# EAGLE design On Axis Encoder - Single Side (EAGLE 9.6.1)

## Sheet 1 of 7: MCU
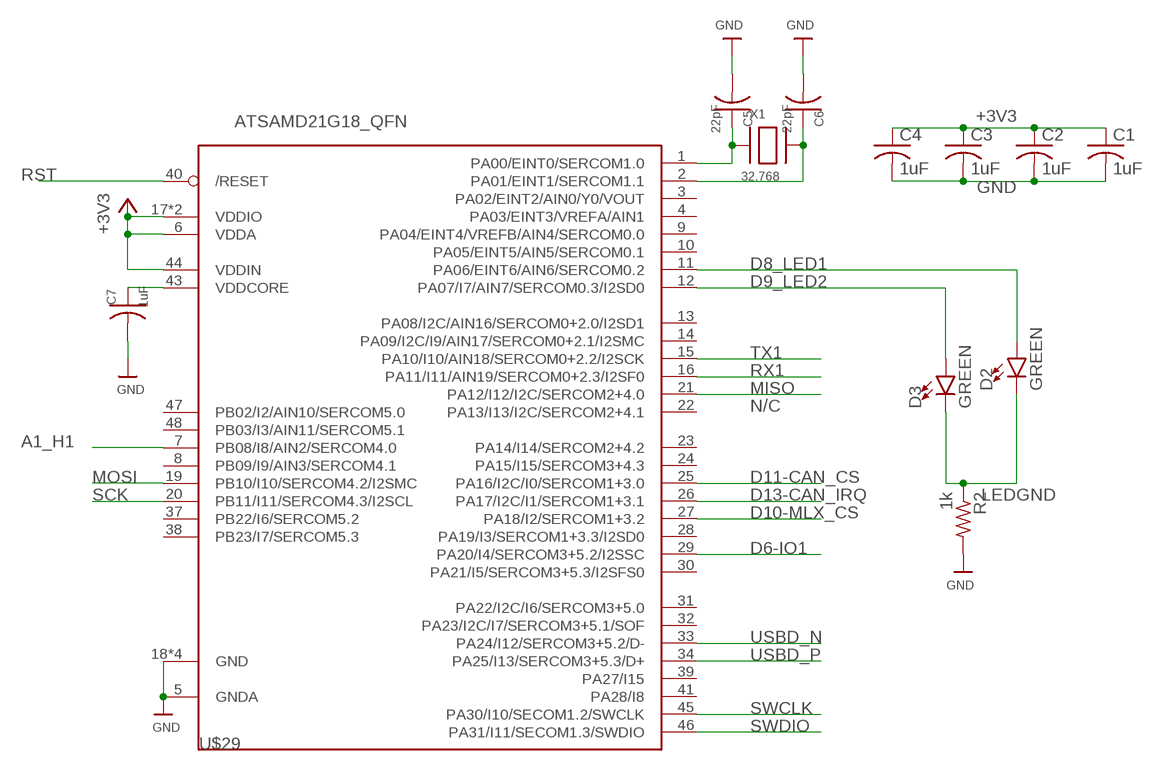
[diagram p0: schematic, sheet 1]

### Parts
C1  1uF  C-USC0603  [C0603]
C2  1uF  C-USC0603  [C0603]
C3  1uF  C-USC0603  [C0603]
C4  1uF  C-USC0603  [C0603]
C5  22pF  C-USC0603  [C0603]
C6  22pF  C-USC0603  [C0603]
C7  1uF  C-USC0603  [C0603]
D2  GREEN  LED-RED0603  [LED-0603]
D3  GREEN  LED-RED0603  [LED-0603]
R2  1k  R-US_R0603  [R0603]
U$29  ATSAMD21G18_QFN  ATSAMD21J_QFN  [MICROBUILDER_TQFN48_7MM]
X1  32.768  XTAL-3.2X1.5  [XTAL3215]

### Nets
+3V3: C1.1 C2.1 C3.1 C4.1 U$29.6(VDDA) U$29.17(VDDIO) U$29.36(VDDIO) U$29.44(VDDIN) ; also sheet 3,4,5,6
A1_H1: U$29.7(PB08/I8/AIN2/SERCOM4.0) ; also sheet 2
D6-IO1: U$29.29(PA20/I4/SERCOM3+5.2/I2SSC) ; also sheet 5
D8_LED1: D2.A U$29.11(PA06/EINT6/AIN6/SERCOM0.2)
D9_LED2: D3.A U$29.12(PA07/I7/AIN7/SERCOM0.3/I2SD0)
D10-MLX_CS: U$29.27(PA18/I2/SERCOM1+3.2) ; also sheet 3,5
D11-CAN_CS: U$29.25(PA16/I2C/I0/SERCOM1+3.0) ; also sheet 6
D13-CAN_IRQ: U$29.26(PA17/I2C/I1/SERCOM1+3.1) ; also sheet 6
GND: C1.2 C2.2 C3.2 C4.2 C5.2 C6.2 C7.2 R2.2 U$29.5(GNDA) U$29.18(GND) U$29.35(GND) U$29.42(GND) U$29.THERMAL(GND) ; also sheet 2,3,4,5,6
LEDGND: D2.C D3.C R2.1 ; also sheet 4
MISO: U$29.21(PA12/I12/I2C/SERCOM2+4.0) ; also sheet 3,5,6
MOSI: U$29.19(PB10/I10/SERCOM4.2/I2SMC) ; also sheet 3,5,6
N$9: C5.1 U$29.1(PA00/EINT0/SERCOM1.0) X1.P$1
N$10: C6.1 U$29.2(PA01/EINT1/SERCOM1.1) X1.P$2
RST: U$29.40(/RESET) ; also sheet 5
RX1: U$29.16(PA11/I11/AIN19/SERCOM0+2.3/I2SF0)
SCK: U$29.20(PB11/I11/SERCOM4.3/I2SCL) ; also sheet 3,5,6
SWCLK: U$29.45(PA30/I10/SECOM1.2/SWCLK) ; also sheet 5
SWDIO: U$29.46(PA31/I11/SECOM1.3/SWDIO) ; also sheet 5
TX1: U$29.15(PA10/I10/AIN18/SERCOM0+2.2/I2SCK)
USBD_N [diff pair]: U$29.33(PA24/I12/SERCOM3+5.2/D-) ; also sheet 5
USBD_P [diff pair]: U$29.34(PA25/I13/SERCOM3+5.3/D+) ; also sheet 5
VDDCORE2: C7.1 U$29.43(VDDCORE)
Unconnected: U$29.3(PA02/EINT2/AIN0/Y0/VOUT) U$29.4(PA03/EINT3/VREFA/AIN1) U$29.8(PB09/I9/AIN3/SERCOM4.1) U$29.9(PA04/EINT4/VREFB/AIN4/SERCOM0.0) U$29.10(PA05/EINT5/AIN5/SERCOM0.1) U$29.13(PA08/I2C/AIN16/SERCOM0+2.0/I2SD1) U$29.14(PA09/I2C/I9/AIN17/SERCOM0+2.1/I2SMC) U$29.22(PA13/I13/I2C/SERCOM2+4.1) U$29.23(PA14/I14/SERCOM2+4.2) U$29.24(PA15/I15/SERCOM3+4.3) U$29.28(PA19/I3/SERCOM1+3.3/I2SD0) U$29.30(PA21/I5/SERCOM3+5.3/I2SFS0) U$29.31(PA22/I2C/I6/SERCOM3+5.0) U$29.32(PA23/I2C/I7/SERCOM3+5.1/SOF) U$29.37(PB22/I6/SERCOM5.2) U$29.38(PB23/I7/SERCOM5.3) U$29.39(PA27/I15) U$29.41(PA28/I8) U$29.47(PB02/I2/AIN10/SERCOM5.0) U$29.48(PB03/I3/AIN11/SERCOM5.1)

### Notes on the sheet
- N/C

## Sheet 2 of 7: PUSH-PULL OUTPUTS
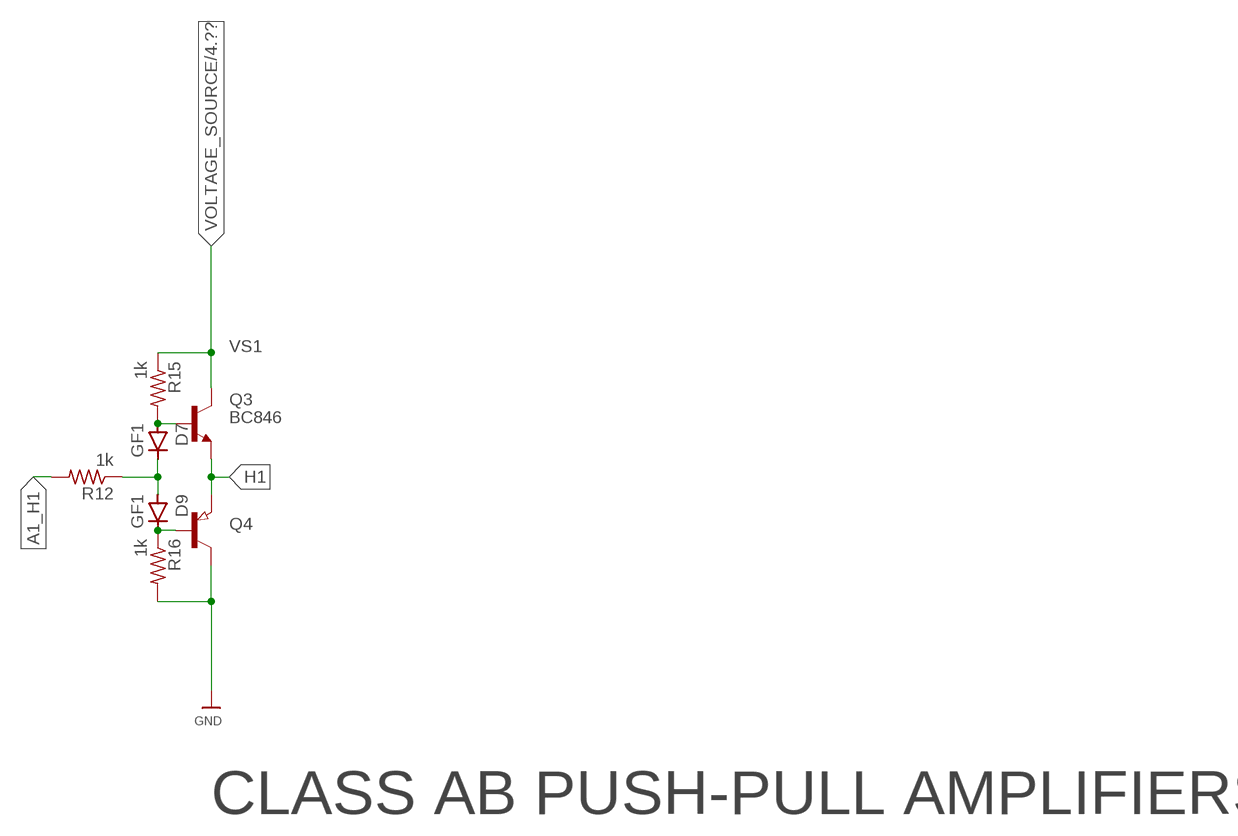
[diagram p1: schematic, sheet 2]

### Parts
D7  GF1  [SMA-DO214AC]
D9  GF1  [SMA-DO214AC]
Q3  BC846  [SOT23]
Q4  PNP-TRANSISTOR_SOT23  [SOT23]
R12  1k  R-US_R0603  [R0603]
R15  1k  R-US_R0603  [R0603]
R16  1k  R-US_R0603  [R0603]

### Nets
A1_H1: R12.2 ; also sheet 1
GND: Q4.3(C) R16.2 ; also sheet 1,3,4,5,6
H1: Q3.2(E) Q4.2(E) ; also sheet 5
N$12: D9.K(C) Q4.1(B) R16.1
N$17: D7.A Q3.1(B) R15.2
N$20: D7.K(C) D9.A R12.1
VS1: Q3.3(C) R15.1

### Notes on the sheet
- CLASS AB PUSH-PULL AMPLIFIERS

## Sheet 3 of 7: MLX Triaxis Hall Effect Sensor
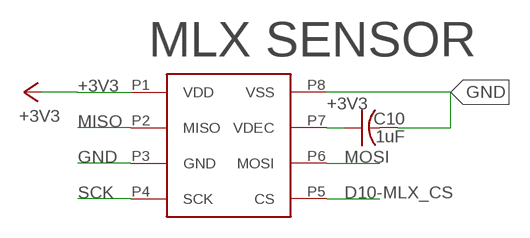
[diagram p2: schematic, sheet 3]

### Parts
C10  1uF  C-USC0603  [C0603]
U$4  MLX90363-SOIC8  [SOIC-8]

### Nets
+3V3: C10.1 U$4.P1(VDD) U$4.P7(VDEC) ; also sheet 1,4,5,6
D10-MLX_CS: U$4.P5(CS) ; also sheet 1,5
GND: C10.2 U$4.P3(GND) U$4.P8(VSS) ; also sheet 1,2,4,5,6
MISO: U$4.P2(MISO) ; also sheet 1,5,6
MOSI: U$4.P6(MOSI) ; also sheet 1,5,6
SCK: U$4.P4(SCK) ; also sheet 1,5,6

### Notes on the sheet
- MLX SENSOR

## Sheet 4 of 7: Voltage Regulator
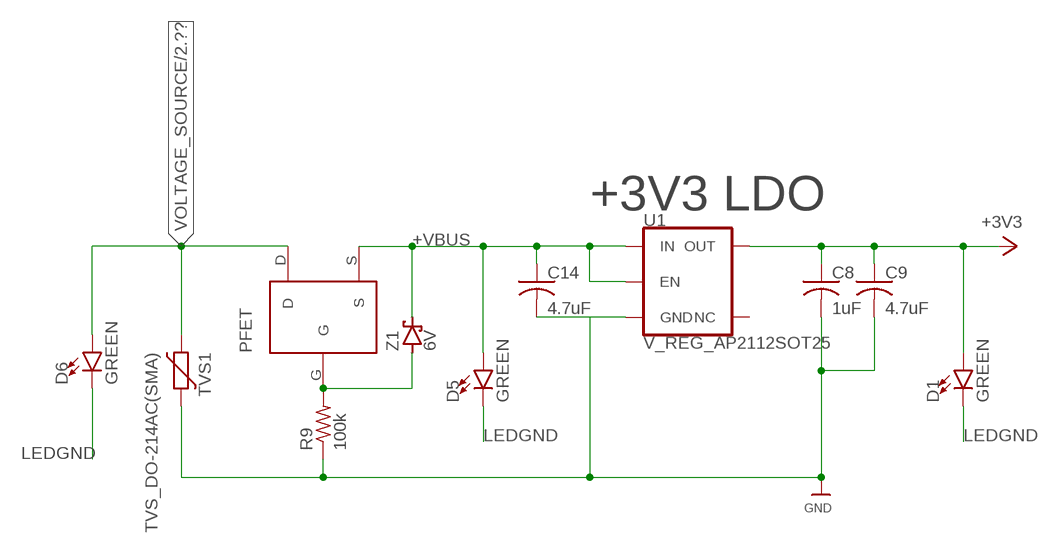
[diagram p3: schematic, sheet 4]

### Parts
C8  1uF  C-USC0603  [C0603]
C9  4.7uF  C-USC0603  [C0603]
C14  4.7uF  C-USC0603  [C0603]
D1  GREEN  LED-RED0603  [LED-0603]
D5  GREEN  LED-RED0603  [LED-0603]
D6  GREEN  LED-RED0603  [LED-0603]
PFET1  PFET  NFET  [SOT323-3_NFET]
R9  100k  R-US_R0603  [R0603]
TVS1  TVS_DO-214AC(SMA)  [DIOM5226X290N]
U1  V_REG_AP2112SOT25  [SOT95P285X140-5N]
Z1  6V  BAS40  [SOT23]

### Nets
+3V3: C8.1 C9.1 D1.A U1.5(OUT) ; also sheet 1,3,5,6
+VBUS: C14.1 D5.A PFET1.S U1.1(IN) U1.3(EN) Z1.3(C) ; also sheet 5
GND: C8.2 C9.2 C14.2 R9.1 TVS1.2 U1.2(GND) ; also sheet 1,2,3,5,6
LEDGND: D1.C D5.C D6.C ; also sheet 1
N$7: PFET1.G R9.2 Z1.1(A)
VOLTAGE_SOURCE: D6.A PFET1.D TVS1.1 ; also sheet 2,5
Unconnected: U1.4(NC)

### Notes on the sheet
- +3V3 LDO
- PFET

## Sheet 5 of 7: Connectors
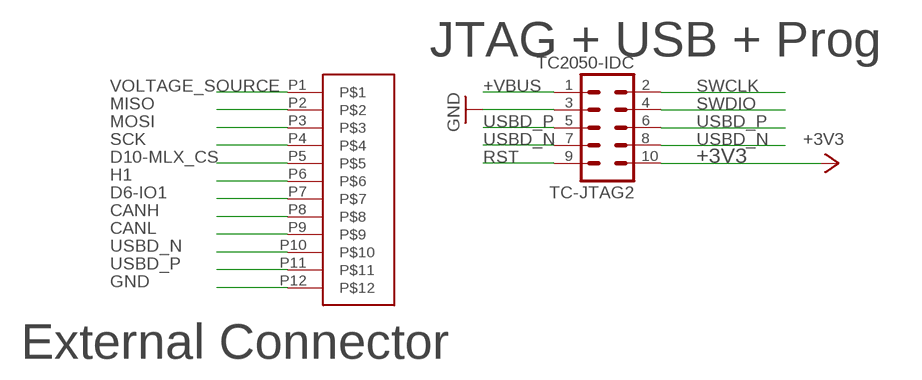
[diagram p4: schematic, sheet 5]

### Parts
TC-JTAG2  TC2050-IDC  [TC2050-IDC]
U$9  BM12B-ZESS-TBT  [JST-BM12B-ZESS-TBT]

### Nets
+3V3: TC-JTAG2.10 ; also sheet 1,3,4,6
+VBUS: TC-JTAG2.1 ; also sheet 4
CANH: U$9.P8 ; also sheet 6
CANL: U$9.P9 ; also sheet 6
D6-IO1: U$9.P7 ; also sheet 1
D10-MLX_CS: U$9.P5 ; also sheet 1,3
GND: TC-JTAG2.3 U$9.P12 ; also sheet 1,2,3,4,6
H1: U$9.P6 ; also sheet 2
MISO: U$9.P2 ; also sheet 1,3,6
MOSI: U$9.P3 ; also sheet 1,3,6
RST: TC-JTAG2.9 ; also sheet 1
SCK: U$9.P4 ; also sheet 1,3,6
SWCLK: TC-JTAG2.2 ; also sheet 1
SWDIO: TC-JTAG2.4 ; also sheet 1
USBD_N [diff pair]: TC-JTAG2.7 TC-JTAG2.8 U$9.P10 ; also sheet 1
USBD_P [diff pair]: TC-JTAG2.5 TC-JTAG2.6 U$9.P11 ; also sheet 1
VOLTAGE_SOURCE: U$9.P1 ; also sheet 2,4

### Notes on the sheet
- JTAG + USB + Prog
- External Connector

## Sheet 6 of 7: CANbus
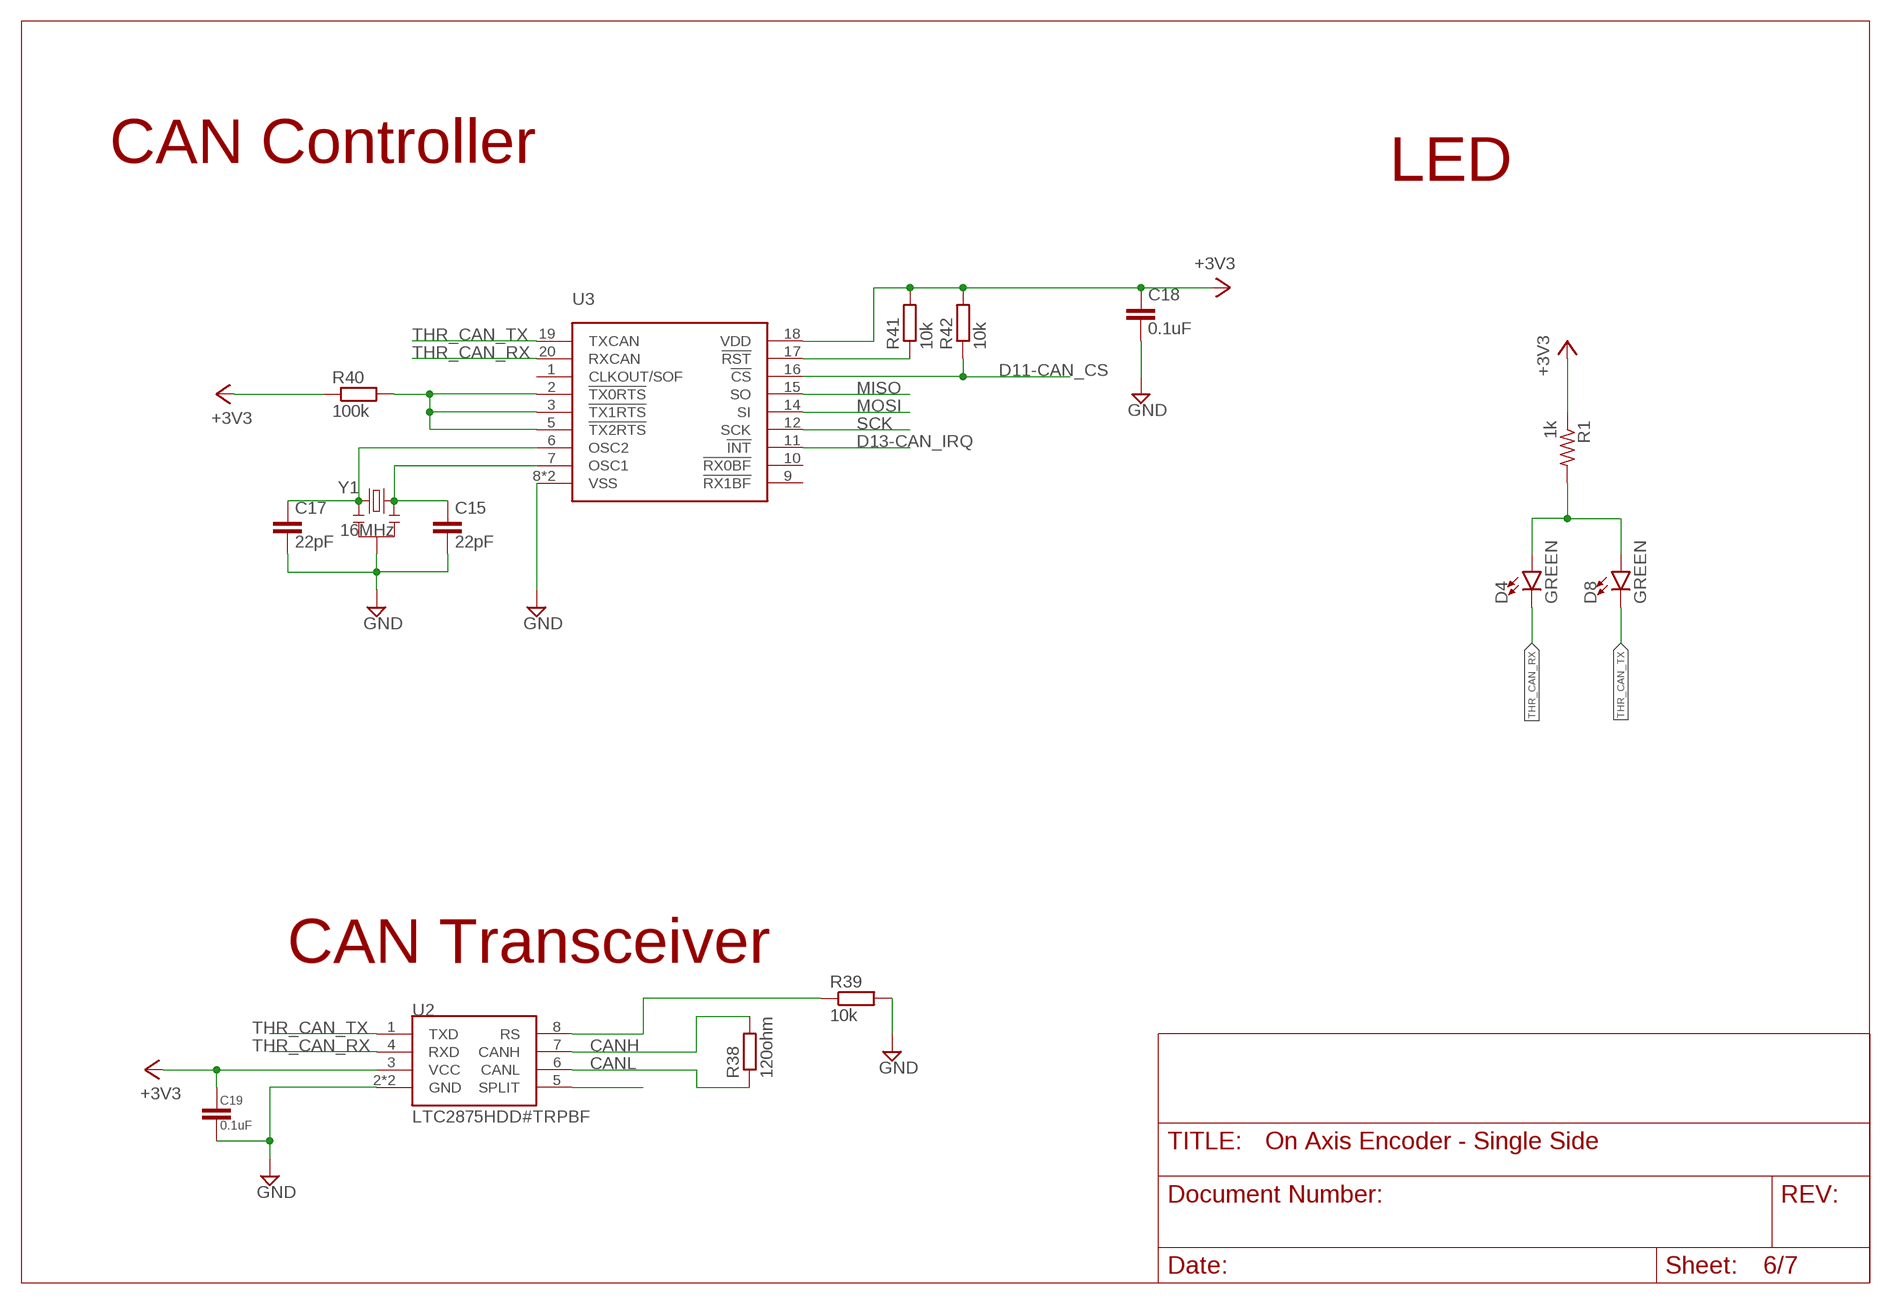
[diagram p5: schematic, sheet 6]

### Parts
C15  22pF  C0603  [C-0603]
C17  22pF  C0603  [C-0603]
C18  0.1uF  C0603  [C-0603]
C19  0.1uF  C0603  [C-0603]
D4  GREEN  LED-RED0603  [LED-0603]
D8  GREEN  LED-RED0603  [LED-0603]
R1  1k  R-US_R0603  [R0603]
R38  120ohm  R0603  [R-0603]
R39  10k  R0603  [R-0603]
R40  100k  R0603  [R-0603]
R41  10k  R0603  [R-0603]
R42  10k  R0603  [R-0603]
U2  LTC2875HDD#TRPBF  LTC2875-8-DFN  [SON50P300X300X80-9T165X238N]
U3  MCP2515-E/ML  MCP2515QFN-20  [QFN50P400X400X100-21T270N]
Y1  16MHz  RESONATORSMD  [RESONATOR-SMD]

### Nets
+3V3: C18.P$1 C19.P$1 R1.1 R40.P$1 R41.P$2 R42.P$2 U2.3(VCC) U3.18(VDD) ; also sheet 1,3,4,5
CANH: R38.P$2 U2.7(CANH) ; also sheet 5
CANL: R38.P$1 U2.6(CANL) ; also sheet 5
D11-CAN_CS: R42.P$1 U3.16(!CS) ; also sheet 1
D13-CAN_IRQ: U3.11(!INT) ; also sheet 1
GND: C15.P$2 C17.P$2 C18.P$2 C19.P$2 R39.P$2 U2.2(GND) U2.9(GND) U3.8(VSS) U3.21(VSS) Y1.2 ; also sheet 1,2,3,4,5
MISO: U3.15(SO) ; also sheet 1,3,5
MOSI: U3.14(SI) ; also sheet 1,3,5
N$26: D4.A D8.A R1.2
N$28: R39.P$1 U2.8(RS)
N$29: U2.5(SPLIT)
N$30: R41.P$1 U3.17(!RST)
N$31: R40.P$2 U3.2(!TX0RTS) U3.3(!TX1RTS) U3.5(!TX2RTS)
N$32: C17.P$1 U3.6(OSC2) Y1.3
N$33: C15.P$1 U3.7(OSC1) Y1.1
SCK: U3.12(SCK) ; also sheet 1,3,5
THR_CAN_RX: D4.C U2.4(RXD) U3.20(RXCAN)
THR_CAN_TX: D8.C U2.1(TXD) U3.19(TXCAN)
Unconnected: U3.1(CLKOUT/SOF) U3.9(!RX1BF) U3.10(!RX0BF)

### Notes on the sheet
- CAN Controller | LED
- CAN Transceiver

## Sheet 7 of 7: 7 DOF IMU

## Library data of the parts
C1-C10 C14 = rcl:C-US: CAPACITOR, American symbol; SPICEPREFIX: C
C15 C17-C19 = Jetfoiler:C
D1-D6 D8 = SparkFun-LED:LED-RED: Red SMD LED Used in manufacturing of most products at SparkFun Packages: 0603 - SMD 0603 package [Product Link] <http://docs.avagotech.com/docs/AV02-0551EN> 0603 SMART - SMD 0603 SMART package ( more efficient and expensive)[Product Link] <http://www.osram-os.com/Graphics/XPic2/00077099_0.pdf> 1206 - SMD1206 package [Product Link] <https://www.sparkfun.com/datasheets/DevTools/LilyPad/Q150OVS4.pdff> SparkFun Products: Pro Mini 328 -5V <https://www.sparkfun.com/products/821> RedBoard <https://www.sparkfun.com/products/12757> IOIO-OTG <https://www.sparkfun.com/products/13613>; PROD_ID: DIO-00819; VALUE: RED
D7 D9 = diode:GF1: DIODE
PFET1 = AlecK:NFET: 20V N Channel MOSFET - SOT23-3 - 1A https://www.diodes.com/assets/Datasheets/ds31859.pdf
Q3 = transistor:BC846: NPN TRANSISTOR
Q4 = semicon-smd-ipc:PNP-TRANSISTOR_: PNP TRANSISTOR
R1 R2 R9 R12 R15 R16 = rcl:R-US_: RESISTOR, American symbol; SPICEPREFIX: R
R38-R42 = Jetfoiler:R
TC-JTAG2 = TagConnect:TC2050-IDC: Tag-Connect In Circuit Programming & Debug Cable 10 Pin http://www.tag-connect.com
TVS1 = Circuit-Protection:TVS: TVS Diode - Generic; CATEGORY: Circuit-Protection; SUB-CATEGORY: TVS-Diode
U1 = Jetfoiler:V_REG_AP2112: AP2112 - 600mA CMOS LDO Regulator w/ Enable The AP2112 is CMOS process low dropout linear regulator with enable function, the regulator delivers a guaranteed 600mA (min.) continuous load current. Features Output Voltage Accuracy: ±1.5% Output Current: 600mA (Min.) Foldback Short Current Protection: 50mA Enable Function to Turn ON/OFF VOUT Low Dropout Voltage (3.3V): 250mV (Typ.) @IOUT=600mA Excellent Load Regulation: 0.2%/A (Typ.) Excellent Line Regulation: 0.02%/V (Typ.) Low Quiescent Current: 55μA (Typ.) Low Standby Current: 0.01μA (Typ.) Low Output Noise: 50μVRMS PSRR: 100Hz -65dB, 1kHz -65dB OTSD Protection Stable with 1.0μF Flexible Cap: Ceramic, Tantalum and Aluminum Electrolytic Operation Temperature Range: -40°C to 85°C ESD: MM 400V, HBM 4000V
U2 = Jetfoiler:LTC2875: Datasheet <https://www.analog.com/media/en/technical-documentation/data-sheets/2875f.pdf>
U3 = Jetfoiler:MCP2515
U$4 = AlecK:MLX90363-SOIC8
U$9 = AlecK:BM12B-ZESS-TBT
U$29 = Jetfoiler:ATSAMD21J
X1 = Jetfoiler:XTAL: Low cost SMT crystals, no capacitors included http://www.ladyada.net/library/eagle
Y1 = SparkFun:RESONATOR: Resonator Small SMD resonator. This is the itty bitty 10/20MHz resonators with built in caps. CSTCE10M0G55 and CSTCE20M0V53. Footprint has been reviewed closely but hasn't been tested yet.
Z1 = diode:BAS40: Silicon Schottky Diodes General-purpose diode for high-speed switching

## Net classes
0 default: width 0.089 mm, drill 0.2 mm, clearance 0.089 mm
1 diff pair: width 0.152 mm, drill 0.2 mm, clearance 0.203 mm

## Board
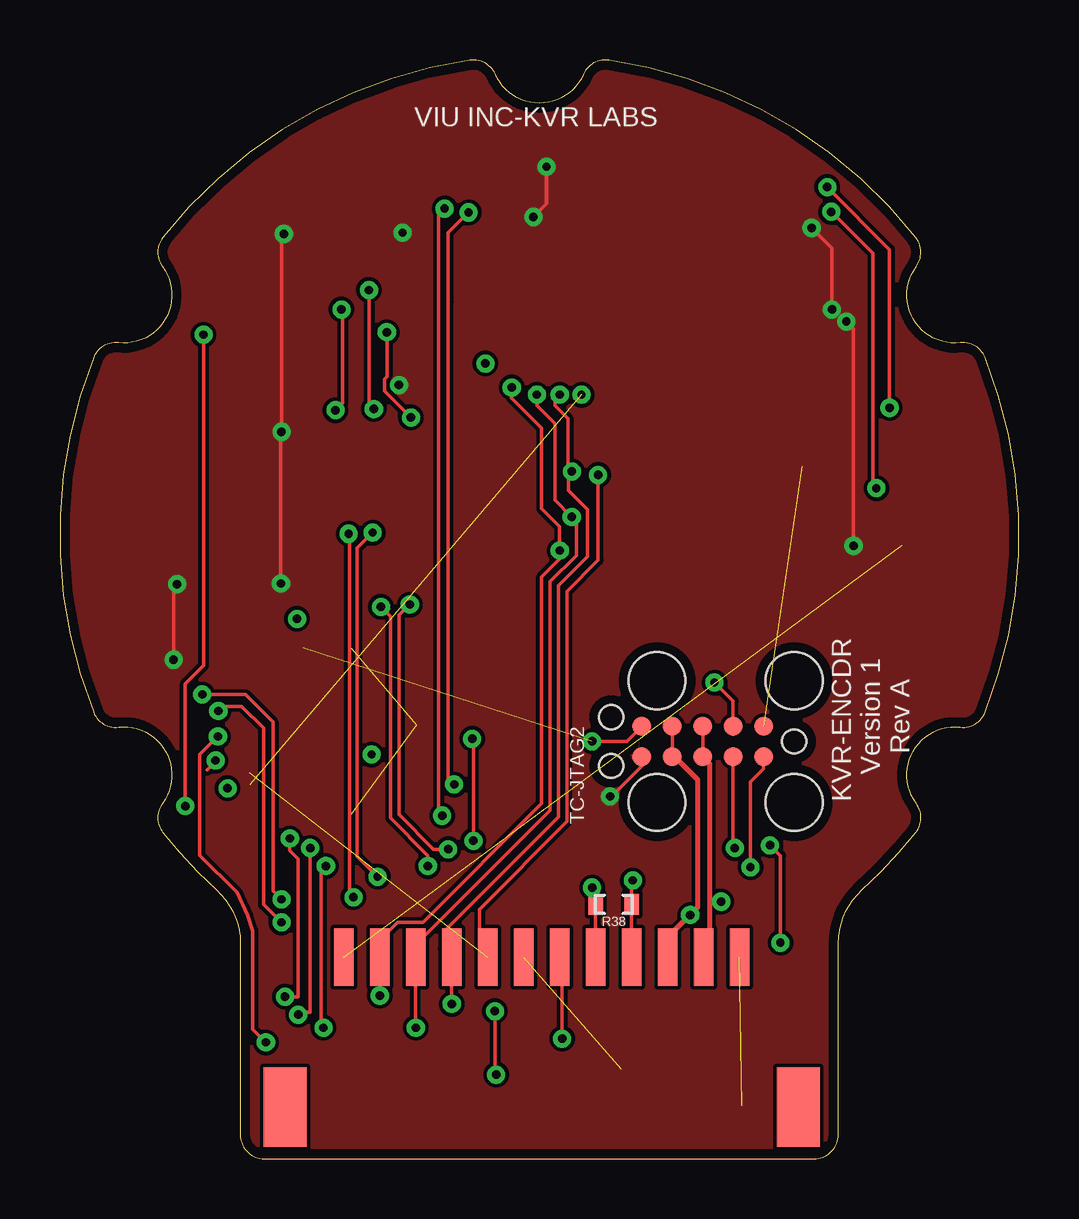
[diagram p6: board, top side]
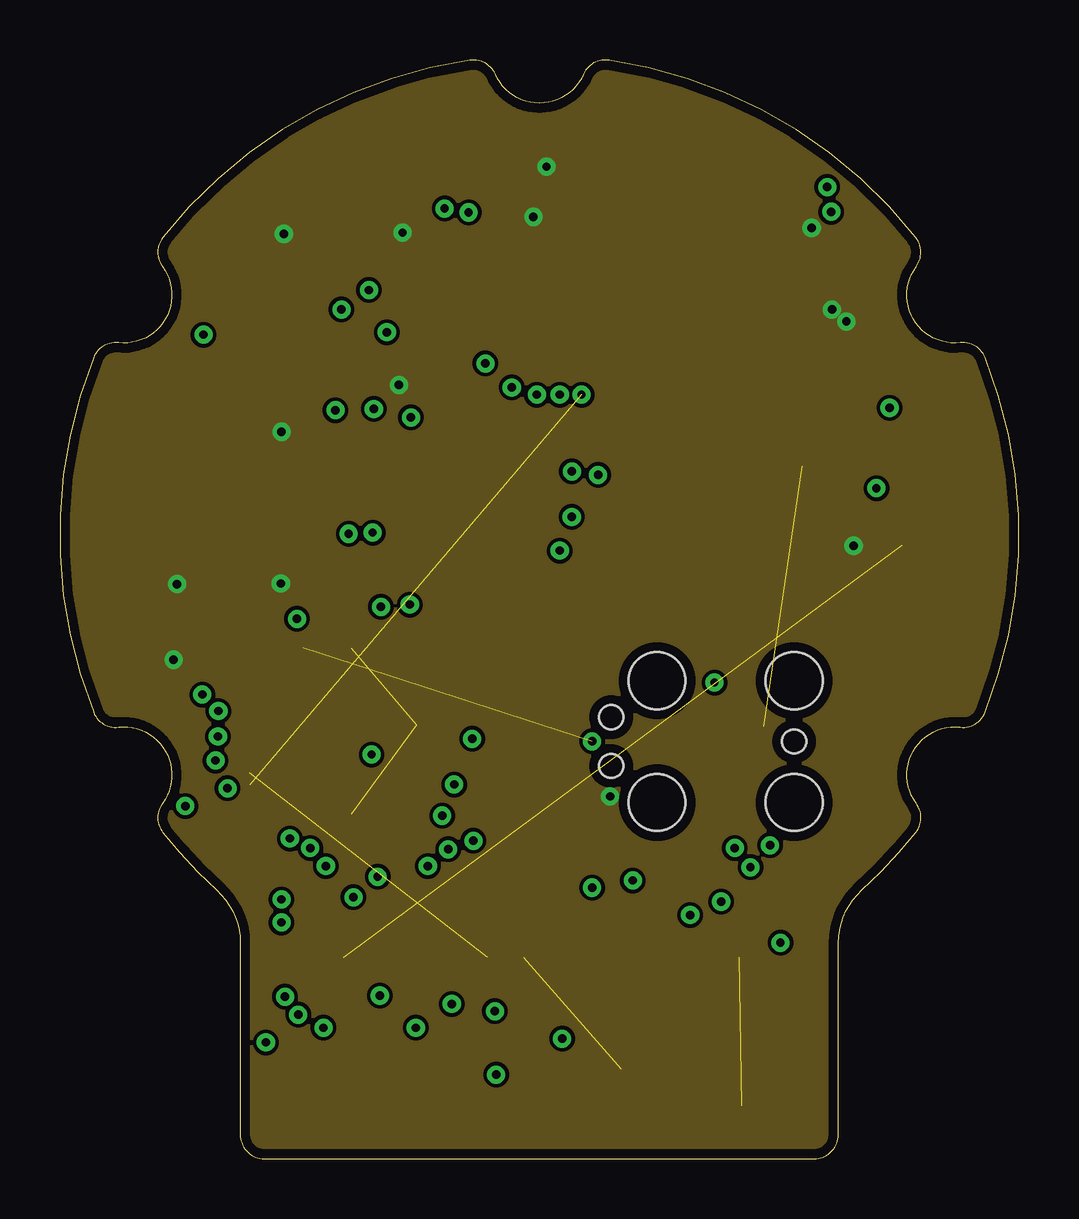
[diagram p7: board, inner layer Route2]
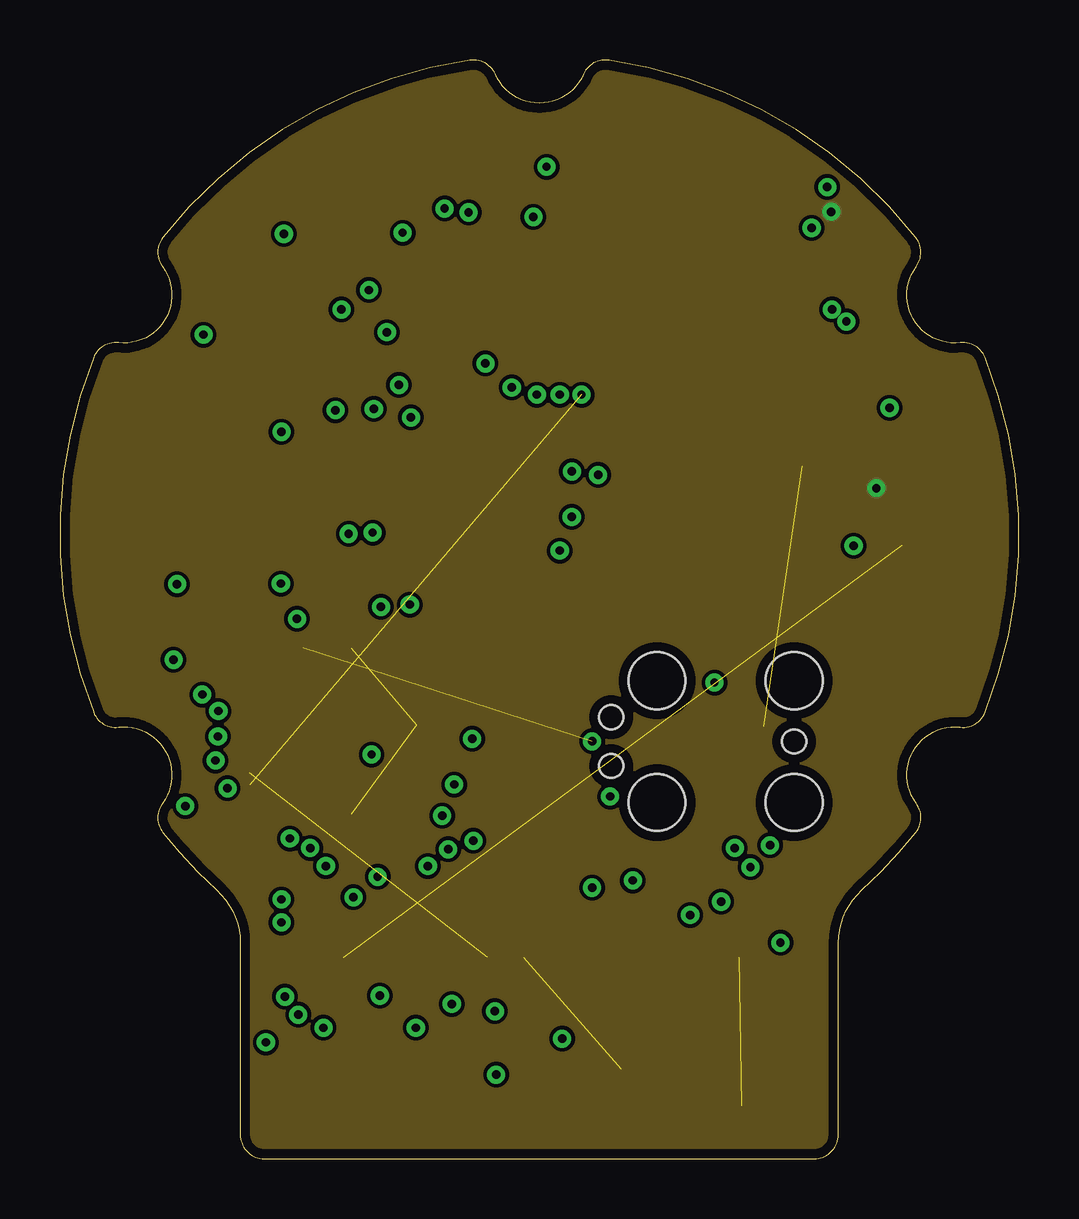
[diagram p8: board, inner layer Route15]
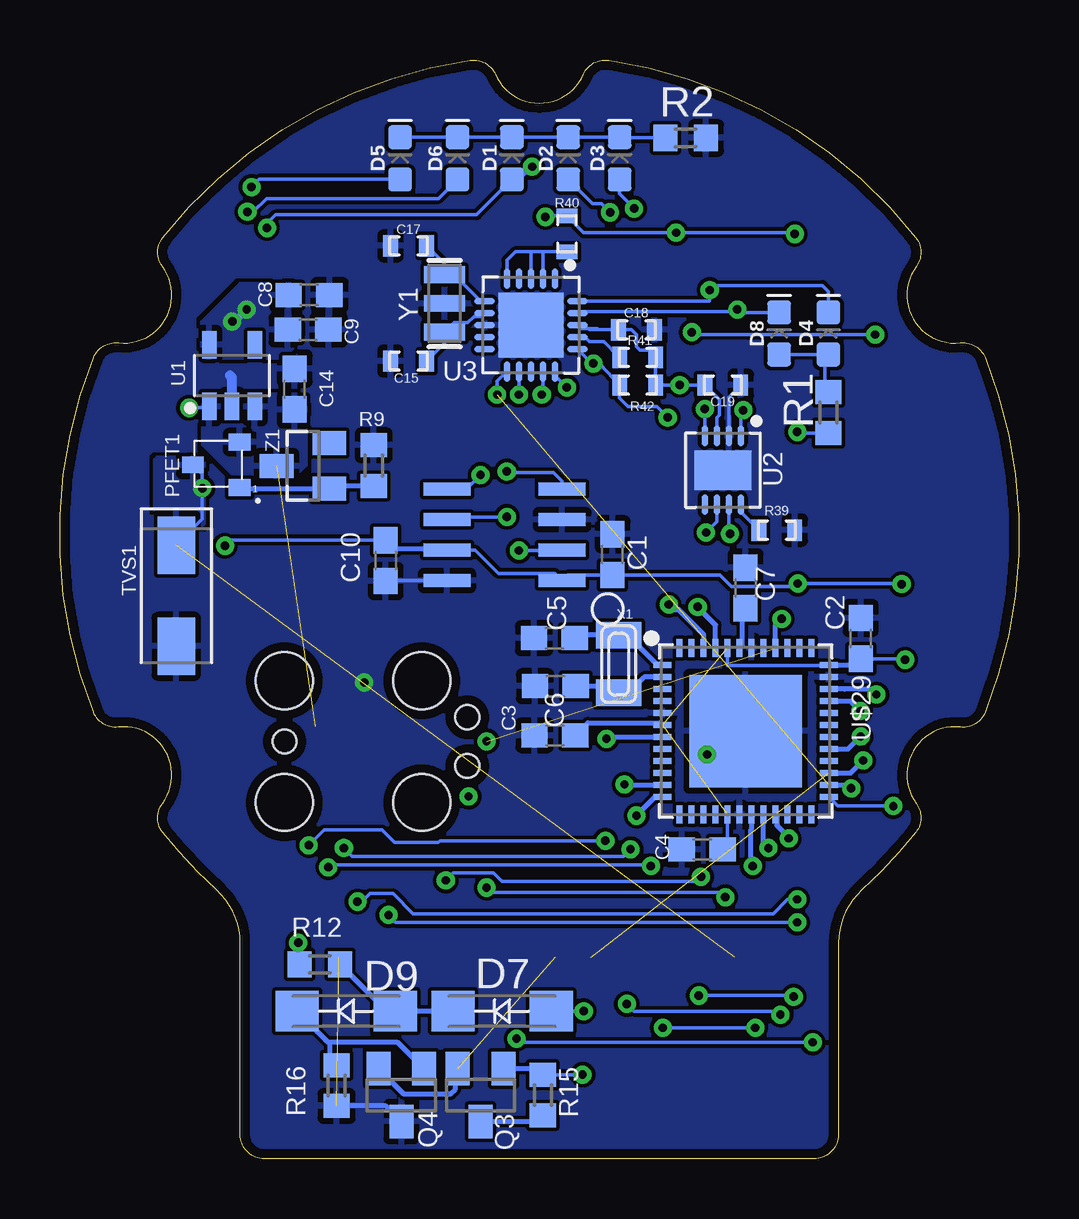
[diagram p9: board, bottom side, seen from below]

Size 39.96 x 45.8 mm. Coordinates in mm from the lower left corner, seen from the top.
Outline: 21.82,45.2 arc-133 18.15,45.2 arc75 17.09,45.79 arc43 4.29,38.4 arc75 4.27,37.19 arc-133 2.44,34.01 arc75 1.4,33.39 arc43 1.4,18.61 arc75 2.44,17.99 arc-133 4.27,14.81 arc75 4.29,13.6 arc9 6.53,11.2 arc-48 7.52,9 7.52,1 arc90 8.52,0 31.45,0 arc90 32.45,1 32.45,9 arc-48 33.43,11.2 arc9 35.68,13.6 arc75 35.69,14.81 arc-133 37.53,17.99 arc75 38.57,18.61 arc43 38.57,33.39 arc75 37.53,34.01 arc-133 35.69,37.19 arc75 35.67,38.4 arc43 22.88,45.79 arc75 21.82,45.2
Copper layers (1*2*15*16): Top 0.035mm / dielectric 1mm / Route2 0.035mm / dielectric 0.18mm / Route15 0.035mm / dielectric 0.18mm / Bottom 0.035mm
Design rules "default *": minimum track width 6mil, minimum drill 0.35mm, track to track 6mil, track to pad 6mil, pad to pad 6mil, via to via 6mil, smd to smd 4mil, copper to edge 16mil, drill to drill 6mil, minimum pad ring 10mil, minimum via ring 8mil, stop-mask expansion 4mil, vias tented up to drill 0mil, thermal gap 10mil

### Footprints (pad centres in the part's own frame; a part is rotated, then mirrored left to right if it is on the bottom)
C0603 = smd 1.1 x 1: 1 -0.85,0; 2 0.85,0
C-0603 = smd 0.61 x 0.889: P$1 -0.749,0; P$2 0.749,0
LED-0603 = smd 1 x 1: A -0.877,0; C 0.877,0
SMA-DO214AC = smd 1.8 x 1.7: A -2.05,0; K 2.05,0
SOT323-3_NFET = smd 0.9 x 0.7: D 1.059,0; G -0.889,0.95; S -0.889,-0.95
SOT23 = smd 1 x 1.4: 1 -0.95,-1.1; 2 0.95,-1.1; 3 0,1.1
R0603 = smd 1 x 1.1: 1 -0.85,0; 2 0.85,0
R-0603 = smd 0.61 x 0.889: P$1 -0.749,0; P$2 0.749,0
TC2050-IDC = smd 0.787 x 0.787: 1 -2.54,-0.635; 2 -2.54,0.635; 3 -1.27,-0.635; 4 -1.27,0.635; 5 0,-0.635; 6 0,0.635; 7 1.27,-0.635; 8 1.27,0.635; 9 2.54,-0.635; 10 2.54,0.635 | hole 0.991: -3.81,0; 3.81,1.016; 3.81,-1.016 | hole 2.375: -3.81,2.54; -3.81,-2.54; 1.905,2.54; 1.905,-2.54
DIOM5226X290N = smd 2.392 x 1.565: 1 -2.108,0; 2 2.108,0
SOT95P285X140-5N = smd 1.146 x 0.597: 1 -1.287,0.95; 2 -1.287,0; 3 -1.287,-0.95; 4 1.287,-0.95; 5 1.287,0.95
SON50P300X300X80-9T165X238N = smd 0.86 x 0.27: 1 -1.435,0.75; 2 -1.435,0.25; 3 -1.435,-0.25; 4 -1.435,-0.75; 5 1.435,-0.75; 6 1.435,-0.25; 7 1.435,0.25; 8 1.435,0.75 | smd 1.65 x 2.38: 9 0,0
QFN50P400X400X100-21T270N = smd 0.837 x 0.264: 1 -1.937,1; 2 -1.937,0.5; 3 -1.937,0; 4 -1.937,-0.5; 5 -1.937,-1; 11 1.937,-1; 12 1.937,-0.5; 13 1.937,0; 14 1.937,0.5; 15 1.937,1 | smd 0.264 x 0.837: 6 -1,-1.937; 7 -0.5,-1.937; 8 0,-1.937; 9 0.5,-1.937; 10 1,-1.937; 16 1,1.937; 17 0.5,1.937; 18 0,1.937; 19 -0.5,1.937; 20 -1,1.937 | smd 2.7 x 2.7: 21 0,0
SOIC-8 = smd 1.95 x 0.55: P1 -2.4,1.9; P2 -2.4,0.63; P3 -2.4,-0.64; P4 -2.4,-1.91; P5 2.4,-1.91; P6 2.4,-0.64; P7 2.4,0.63; P8 2.4,1.9
JST-BM12B-ZESS-TBT = smd 0.8 x 2.4: P1 -8.25,0; P2 -6.75,0; P3 -5.25,0; P4 -3.75,0; P5 -2.25,0; P6 -0.75,0; P7 0.75,0; P8 2.25,0; P9 3.75,0; P10 5.25,0; P11 6.75,0; P12 8.25,0 | smd 1.8 x 3.3: P13 10.7,-6.25; P14 -10.7,-6.25
MICROBUILDER_TQFN48_7MM = smd 0.25 x 0.75: 1 -2.75,-3.475; 2 -2.25,-3.475; 3 -1.75,-3.475; 4 -1.25,-3.475; 5 -0.75,-3.475; 6 -0.25,-3.475; 7 0.25,-3.475; 8 0.75,-3.475; 9 1.25,-3.475; 10 1.75,-3.475; 11 2.25,-3.475; 12 2.75,-3.475; 25 2.75,3.475; 26 2.25,3.475; 27 1.75,3.475; 28 1.25,3.475; 29 0.75,3.475; 30 0.25,3.475; 31 -0.25,3.475; 32 -0.75,3.475; 33 -1.25,3.475; 34 -1.75,3.475; 35 -2.25,3.475; 36 -2.75,3.475 | smd 0.75 x 0.25: 13 3.475,-2.75; 14 3.475,-2.25; 15 3.475,-1.75; 16 3.475,-1.25; 17 3.475,-0.75; 18 3.475,-0.25; 19 3.475,0.25; 20 3.475,0.75; 21 3.475,1.25; 22 3.475,1.75; 23 3.475,2.25; 24 3.475,2.75; 37 -3.475,2.75; 38 -3.475,2.25; 39 -3.475,1.75; 40 -3.475,1.25; 41 -3.475,0.75; 42 -3.475,0.25; 43 -3.475,-0.25; 44 -3.475,-0.75; 45 -3.475,-1.25; 46 -3.475,-1.75; 47 -3.475,-2.25; 48 -3.475,-2.75 | smd 4.7 x 4.7: THERMAL 0,0
XTAL3215 = smd 1.1 x 1.9: P$1 1.2,0; P$2 -1.2,0
RESONATOR-SMD = smd 0.7 x 1.7: 1 -1.2,0; 2 0,0; 3 1.2,0

### Placement (x,y rotation side)
C1  16.93,25.18 90 bottom
C2  6.58,21.69 90 bottom
C3  19.33,17.65 180 bottom
C4  13.19,12.9 180 bottom
C5  19.35,21.7 180 bottom
C6  19.31,19.7 180 bottom
C7  11.38,23.79 90 bottom
C8  29.58,36 0 bottom
C9  29.62,34.55 0 bottom
C10  26.38,24.93 270 bottom
C14  30.18,32.08 90 bottom
C15  25.43,33.25 180 bottom
C17  25.43,38.05 180 bottom
C18  15.93,34.55 0 bottom
C19  12.33,32.25 0 bottom
D1  21.13,41.7 90 bottom
D2  18.78,41.7 90 bottom
D3  16.63,41.7 90 bottom
D4  7.93,34.4 90 bottom
D5  25.79,41.7 90 bottom
D6  23.39,41.7 90 bottom
D7  21.53,6.15 180 bottom
D8  9.98,34.4 90 bottom
D9  28.03,6.15 180 bottom
PFET1  33.36,28.92 180 bottom
Q3  22.43,2.65 180 bottom
Q4  25.73,2.65 180 bottom
R1  7.93,31.1 90 bottom
R2  13.88,42.55 0 bottom
R9  26.88,28.89 270 bottom
R12  29.13,8.1 180 bottom
R15  19.83,2.65 90 bottom
R16  28.43,3.05 270 bottom
R38  23.08,10.6 180 top
R39  10.08,26.2 0 bottom
R40  18.83,38.55 270 bottom
R41  15.88,33.4 0 bottom
R42  15.88,32.25 0 bottom
TC-JTAG2  26.79,17.39 180 top
TVS1  35.11,23.47 270 bottom
U1  32.79,32.64 90 bottom
U2  12.33,28.7 270 bottom
U3  20.33,34.75 270 bottom
U$4  21.43,26 180 bottom
U$9  20.08,8.4 0 top
U$29  11.38,17.82 270 bottom
X1  16.67,20.62 90 bottom
Y1  23.93,35.65 90 bottom
Z1  29.83,28.88 90 bottom

### Tracks (layer width: path | path; a pad name or v marks a point on that pad's centre or on a via)
+3V3  (via drill 0.35)  (2 unrouted)
  Top 0.152: TC-JTAG2.10 24.25,16.37 22.98,15.1 v22.93,15.1 | v31.33,38.8 32.18,37.95 v32.18,35.4 | v20.28,41.35 20.28,39.81 v19.73,39.26 | 14.28,32.4 v14.13,32.25 | v9.33,38.55 9.23,38.45 v9.23,30.3 9.21,30.27 v9.21,23.98 | v33.08,25.55 33.08,34.6 v32.78,34.9 | v4.73,20.8 4.73,23.8 v4.88,23.95
  Bottom 0.152: 18.13,34.75 U3.18 18.26,34.61 17.96,34.61 | C1.1 16.65,24.05 | v19.73,39.26 19.62,39.15 19.47,39.3 R40.P$1 18.13,38.6 v14.28,38.6 9.38,38.6 v9.33,38.55 | C1.1 16.74,24.33 | U$29.17 12.13,13.11 C4.1 | U$29.44 12.13,20.55 7.93,20.55 U$29.36 | C2.1 6.54,20.8 | C2.1 6.76,20.84 7.03,20.57 | C2.1 6.6,20.84 6.87,20.57 | v31.33,38.8 31.33,39 30.98,39.35 22.6,39.35 D1.A 20.81,40.82 v20.28,41.35 | U2.3 12.58,30.89 12.48,31 12.48,31.64 C19.P$1 v14.13,32.25 R42.P$2 R41.P$2 15.43,33.7 15.78,33.7 15.93,33.85 15.93,34.35 16.13,34.55 C18.P$1 17.9,34.55 17.96,34.61 | 17.96,34.61 17.56,34.61 | R1.1 9.18,30.25 v9.23,30.3 | C10.1 32.85,25.78 v33.08,25.55 | C1.1 18.8,24.33 U$4.P1 19.33,24.4 21.68,24.4 22.65,25.37 U$4.P7 | C1.1 12.45,24.33 11.98,23.86 9.32,23.86 v9.21,23.98 4.91,23.98 v4.88,23.95 | C2.1 4.77,20.84 v4.73,20.8
  Bottom 0.2: U$29.6 14.96,18.17 17.96,18.17 C3.1 18.73,17.65 | U$29.36 7.03,20.57 6.87,20.57 | U$4.P7 24.3,25.37 24.31,25.43 26.03,25.43 C10.1
  Bottom 0.305: v32.78,34.9 32.68,34.9 v32.18,35.4
  pour Route2 (isolate 0.127, rank 6): -8.82,51.5 -8.82,-7 47.48,-7 47.48,51.5
  pour Bottom (isolate 0.1): 33.33,33.35 30.63,33.35 29.93,34.05 29.93,36.5 32.48,36.5 34.08,34.9 34.08,33.35
  pour Top (isolate 0.127, rank 6): -11.37,52.7 -11.37,-8.5 49.33,-8.5 49.33,52.7
+VBUS  (via drill 0.35)  (1 unrouted)
  Top 0.152: v31.98,40.5 34.58,37.9 v34.58,31.3
  Bottom 0.152: D5.A 31.66,40.82 v31.98,40.5 | v34.58,31.3 33.8,31.3 U1.1
  pour Bottom (isolate 0.1): 34.03,31.9 34.03,29.75 32.78,28.5 32.73,28.5 32.63,28.4 30.18,28.4 29.68,28.9 29.68,31.85 29.73,31.9
A1_H1  (via drill 0.35)
  Top 0.152: v30.03,9 30.03,12.63 v29.6,13.07 | v17.23,13.25 17.23,17.45 v17.18,17.5
  Bottom 0.152: R12.2 29.98,8.95 v30.03,9 | v29.6,13.07 28.96,13.7 26.53,13.7 26.01,13.18 24.2,13.18 24.13,13.25 v17.23,13.25
  Bottom 0.2: v17.18,17.5 17.11,17.57 U$29.7
CANH  (via drill 0.35)
  Top 0.152: U$9.P8 22.33,11.15 v22.18,11.3 22.18,10.75 R38.P$2 | v12.23,10.9 12.08,11.05 12.08,26 v12.03,26.05
  Bottom 0.152: v22.18,11.3 21.98,11.1 12.43,11.1 v12.23,10.9 | U2.7 12.08,26.1 v12.03,26.05
CANL  (via drill 0.35)
  Top 0.152: U$9.P9 R38.P$1 | v23.88,11.6 23.83,11.55 R38.P$1 | R38.P$1 | v13.24,11.75 12.38,12.61 12.38,25.45 v13.03,26.1
  Bottom 0.152: v13.24,11.75 13.24,11.56 21.54,11.56 21.89,11.91 23.58,11.91 v23.88,11.6 | U2.6 12.58,26.55 v13.03,26.1
D6-IO1  (via drill 0.35)
  Top 0.152: U$9.P7 20.93,8.3 v20.93,5 | v8.58,4.85 8.03,5.4 8.03,9.5 7.83,10.15 7.38,11.1 5.83,12.65 5.83,16.85 v6.58,17.6
  Bottom 0.152: v20.93,5 20.78,4.85 v8.58,4.85
  Bottom 0.2: U$29.29 7.11,17.07 v6.58,17.6
D8_LED1  (via drill 0.35)
  Top 0.152: v16.43,15.6 16.18,15.85 16.18,35.75 16.19,35.74 16.19,38.6 v17.03,39.45
  Bottom 0.152: D2.A 17.76,39.8 17.38,39.8 v17.03,39.45
  Bottom 0.2: v16.43,15.6 16.43,15.57 U$29.11
D9_LED2  (via drill 0.35)
  Top 0.152: v16.03,39.61 15.78,39.36 15.78,14.45 v15.93,14.3
  Bottom 0.152: D3.A 16.63,40.22 16.07,39.66 16.03,39.62 v16.03,39.61
  Bottom 0.2: U$29.12 14.88,15.05 15.18,15.05 v15.93,14.3
D10-MLX_CS  (via drill 0.35)  (1 unrouted)
  Top 0.152: U$9.P5 17.48,8.75 17.48,10.4 21.13,14.05 21.13,23.65 22.43,24.95 v22.43,28.5 | v6.48,16.6 6.48,16.55 6.14,16.2
  Bottom 0.152: U$4.P5 23.02,27.91 v22.43,28.5
  Bottom 0.2: U$29.27 7.01,16.07 v6.48,16.6
D11-CAN_CS  (via drill 0.35)
  Top 0.152: v5.23,14.7 5.23,19.79 5.98,20.55 v5.98,34.35 | v13.63,34.45 13.63,32.6 13.53,32.5 13.53,32 13.88,31.64 13.89,31.64 v14.63,30.9
  Bottom 0.152: U3.16 17.8,33.15 v17.73,33.15 17.48,33.15 17.43,33.1 R42.P$1 16.63,31.7 16.28,31.35 15.08,31.35 v14.63,30.9 | U$29.25 7.54,14.7 v5.23,14.7 | v5.98,34.35 13.53,34.35 v13.63,34.45
D13-CAN_IRQ  (via drill 0.35)  (1 unrouted)
  Bottom 0.152: 21.36,32.81 U3.11 21.74,32.4 v21.74,31.85 | v6.98,15.44 7.02,15.48 7.04,15.48
  Bottom 0.2: U$29.26 7.13,15.57 7.04,15.48
GND  (via drill 0.35)  (1 unrouted)
  Top 0.152: TC-JTAG2.3 28.06,19.07 v27.28,19.85
  Bottom 0.152: R9.1 27.01,29.87 | v12.99,16.85 12.02,17.82 U$29.THERMAL 10.03,16.47 10.03,16.1 | 26.31,24.01 C10.2 26.36,24.1 U$4.P8 | U2.2 12.08,30.94 12.09,30.95 12.09,31.74 C19.P$2
  Bottom 0.2: Q4.3 26.38,2.2 R16.2
  Bottom 0.406: U1.2 32.79,32.56 32.88,32.65
  pour Bottom (isolate 0.127, rank 6): -4.42,47.45 -4.42,-3.2 42.48,-3.2 42.48,47.45
H1  (1 unrouted)
  Bottom 0.152: 23.81,4.18 23.48,3.85 Q3.2
  Bottom 0.2: 23.78,3.35 Q3.2 | Q4.2 25.63,2.7 23.68,2.7 23.48,2.9 23.48,3.85
LEDGND
  Bottom 0.152: D5.C D6.C D1.C D2.C D3.C 16.61,42.55 R2.1
MISO  (via drill 0.35)
  Top 0.152: v18.83,32.15 18.83,31.7 20.08,30.45 20.08,27.1 20.83,26.35 v20.83,25.35 20.83,25 20.08,24.25 20.08,14.8 15.13,9.85 14.08,9.85 13.33,9.1 U$9.P2 | U$9.P2 13.33,8.95 | v9.58,13.35 9.58,12.85 9.93,12.5 9.93,6.75 v9.38,6.75 | U$9.P2 v13.33,6.8
  Bottom 0.152: 19.01,25.35 U$4.P2 19.05,25.35 v20.83,25.35 | U3.15 19.33,32.65 v18.83,32.15 | v13.33,6.8 9.43,6.8 v9.38,6.75
  Bottom 0.2: U$29.21 10.08,14.29 10.08,13.9 9.58,13.4 v9.58,13.35
MOSI  (via drill 0.35)
  Top 0.152: v19.88,31.85 19.88,31.4 20.63,30.65 20.63,27.45 v21.33,26.75 21.53,26.55 21.53,25.15 20.43,24.05 20.43,14.52 14.83,8.92 U$9.P3 v14.83,5.46 | v11.08,12.2 10.88,12 10.88,6.45 | 10.88,6.45 | 10.88,6.45 10.88,5.55 v10.98,5.46
  Bottom 0.152: 19.83,32.45 U3.14 19.83,31.9 v19.88,31.85 | v21.33,26.75 23.72,26.75 U$4.P6 | v10.98,5.46 v14.83,5.46
  Bottom 0.2: 11.08,14.29 U$29.19 11.13,13.75 11.18,13.7 11.18,12.3 v11.08,12.2
N$7
  Bottom 0.2: R9.2 28.62,28.04 Z1.1 32.43,27.93 PFET1.G
N$9
  Bottom 0.2: C5.1 18.11,21.82 X1.P$1 16.3,21.82 15.05,20.57 U$29.1
N$10
  Bottom 0.2: C6.1 17.45,19.7 16.86,19.61 X1.P$2 | X1.P$2 | U$29.2 15.61,20.07 16.26,19.42 X1.P$2
N$12
  Bottom 0.2: 24.98,3.95 Q4.1 25.88,4.85 28.73,4.85 | 28.73,4.85 28.73,4.2 R16.1 | D9.K 28.78,4.85 28.73,4.85
N$17  (via drill 0.35)
  Top 0.152: v18.13,6.15 18.13,3.55 v18.18,3.5
  Bottom 0.152: D7.A v18.13,6.15 | v18.18,3.5 R15.2
  Bottom 0.2: D7.A 19.91,5.73 | R15.2 20.08,3.75 Q3.1
N$20
  Bottom 0.2: D7.K D9.A 26.33,6.15 R12.1
N$26
  Bottom 0.152: D4.A 8.08,33.52 | 8.08,33.52 D8.A | R1.2 8.08,32.1 8.08,33.52
N$28
  Bottom 0.152: R39.P$1 11.58,26.95 U2.8
N$30
  Bottom 0.152: U3.17 18.1,34.25 17.9,34.05 17.28,34.05 R41.P$1
N$31
  Bottom 0.152: U3.5 21.33,37.45 20.98,37.8 20.33,37.8 | R40.P$2 19.88,37.8 | 19.88,37.8 20.33,37.8 | 19.88,37.8 19.83,37.75 U3.2 | U3.3 20.33,37.8
N$32
  Bottom 0.152: C17.P$1 23.93,37.3 Y1.3 23.53,36.85 22.43,35.75 U3.6
N$33
  Bottom 0.152: C15.P$1 23.93,34 Y1.1 23.53,34.85 22.97,34.85 22.71,35.11 22.41,35.11 U3.7
RST  (via drill 0.35)  (1 unrouted)
  Top 0.152: TC-JTAG2.9 23.63,17.4 v22.18,17.4
  Bottom 0.2: U$29.40 10.13,22.25 v9.88,22.5
SCK  (via drill 0.35)
  Top 0.152: v20.83,31.85 20.63,31.65 20.63,31.4 21.18,30.85 21.18,28.65 v21.34,28.65 21.19,28.5 21.19,27.85 21.98,27.06 21.98,25.1 20.78,23.9 20.78,14.25 15.98,9.45 15.98,8.75 U$9.P4 v16.33,6.45 | v10.43,12.95 10.43,6.1 10.03,6.1 v9.93,6
  Bottom 0.152: U3.12 v20.83,31.85 | v21.34,28.65 21.29,28.6 19.38,28.6 19.03,28.25 U$4.P4 | v16.33,6.45 16.03,6.15 10.08,6.15 v9.93,6
  Bottom 0.2: v10.43,12.95 10.63,13.15 U$29.20
SWCLK  (via drill 0.35)
  Top 0.152: TC-JTAG2.2 29.33,16.25 28.78,15.7 v28.78,12.15 | v13.38,23 13.78,22.6 13.78,14.2 15.33,12.65 v15.33,12.2
  Bottom 0.152: v15.33,12.2 15.38,12.25 28.68,12.25 v28.78,12.15
  Bottom 0.2: U$29.45 12.63,22.25 v13.38,23
SWDIO  (via drill 0.35)
  Top 0.152: TC-JTAG2.4 28.06,13.02 v28.13,12.95 | v16.18,12.9 15.58,12.9 14.14,14.35 14.14,22.66 v14.58,23.1
  Bottom 0.152: v16.18,12.9 16.48,12.6 27.78,12.6 v28.13,12.95
  Bottom 0.2: v14.58,23.1 14.38,22.9 14.18,22.9 13.13,21.85 U$29.46
THR_CAN_RX  (via drill 0.35)
  Top 0.152: v12.88,36.21 12.88,31.45 v13.08,31.25
  Bottom 0.152: 18.1,35.75 U3.20 12.88,35.75 v12.88,36.21 12.69,36.4 8.18,36.4 7.93,36.15 D4.C | v13.08,31.25 U2.4
THR_CAN_TX  (via drill 0.35)
  Top 0.152: v11.73,35.4 11.78,35.35 11.78,31.5 v11.48,31.2
  Bottom 0.152: 18.03,35.25 U3.19 18.25,35.25 18.2,35.3 11.83,35.3 v11.73,35.4 11.61,35.28 D8.C | U2.1 11.58,31.1 v11.48,31.2
USBD_N  (via drill 0.35)
  Top 0.152: 25.63,16.76 TC-JTAG2.8 TC-JTAG2.7 | 25.33,9.22 U$9.P10 | v9.23,9.85 8.48,10.6 8.48,17.95 7.58,18.85 6.79,18.85 v6.6,18.66
  Top 0.2: 25.63,16.76 26.58,15.8 26.58,10.47 v26.27,10.16 25.33,9.22
  Bottom 0.152: v9.23,9.85 v9.24,9.86 25.97,9.86 v26.27,10.16
  Bottom 0.2: U$29.33 6.95,19.07 6.95,19.01 v6.6,18.66
USBD_P  (via drill 0.35)
  Top 0.152: TC-JTAG2.6 TC-JTAG2.5 | v27.56,10.72 27.55,10.7 | 27.08,8.65 U$9.P11 | v5.93,19.35 7.73,19.35 8.88,18.2 8.88,11.16 v9.23,10.81
  Top 0.2: TC-JTAG2.6 27.08,16.46 27.08,10.7 | 27.55,10.7 27.08,10.7 | 27.08,10.7 27.08,8.65
  Bottom 0.152: v27.56,10.72 27.36,10.72 27.03,11.05 26.08,11.05 25.25,10.21 10.23,10.21 9.63,10.81 v9.23,10.81
  Bottom 0.2: v5.93,19.35 6.15,19.57 6.65,19.57 6.67,19.59 7.23,19.59 7.26,19.57 U$29.34
VDDCORE2
  Bottom 0.2: U$29.43 11.53,21.39 11.53,22.7 11.38,22.85 C7.1
VOLTAGE_SOURCE  (via drill 0.35)  (1 unrouted)
  Top 0.152: v32.15,39.47 33.88,37.74 33.88,28.1 v34.03,27.95
  Bottom 0.152: D6.A 24.19,40.02 31.35,40.02 31.9,39.47 v32.15,39.47 | PFET1.D 34.03,28.53 v34.03,27.95 34.03,26.66 TVS1.1
  pour Route15 (isolate 0.127, rank 6): -7.07,49.5 -7.07,-5.25 45.08,-5.25 45.08,49.5
  pour Bottom (isolate 0.1): 35.88,26.3 34.08,26.3 33.93,26.45 33.93,29.25 35.93,29.25 36.03,29.15 36.03,26.45
VS1
  Bottom 0.152: Q3.3 22.18,1.8
  Bottom 0.2: Q3.3 20.08,1.55 R15.1

### Text on the board
tNames: VIU INC-KVR LABS | KVR-ENCDR / Version 1 / Rev A